# Altium schematic sheet Power_Regulators_Digital_2.SchDoc
size A4; DocumentNumber: 31; SheetNumber: 31; SheetTotal: 47
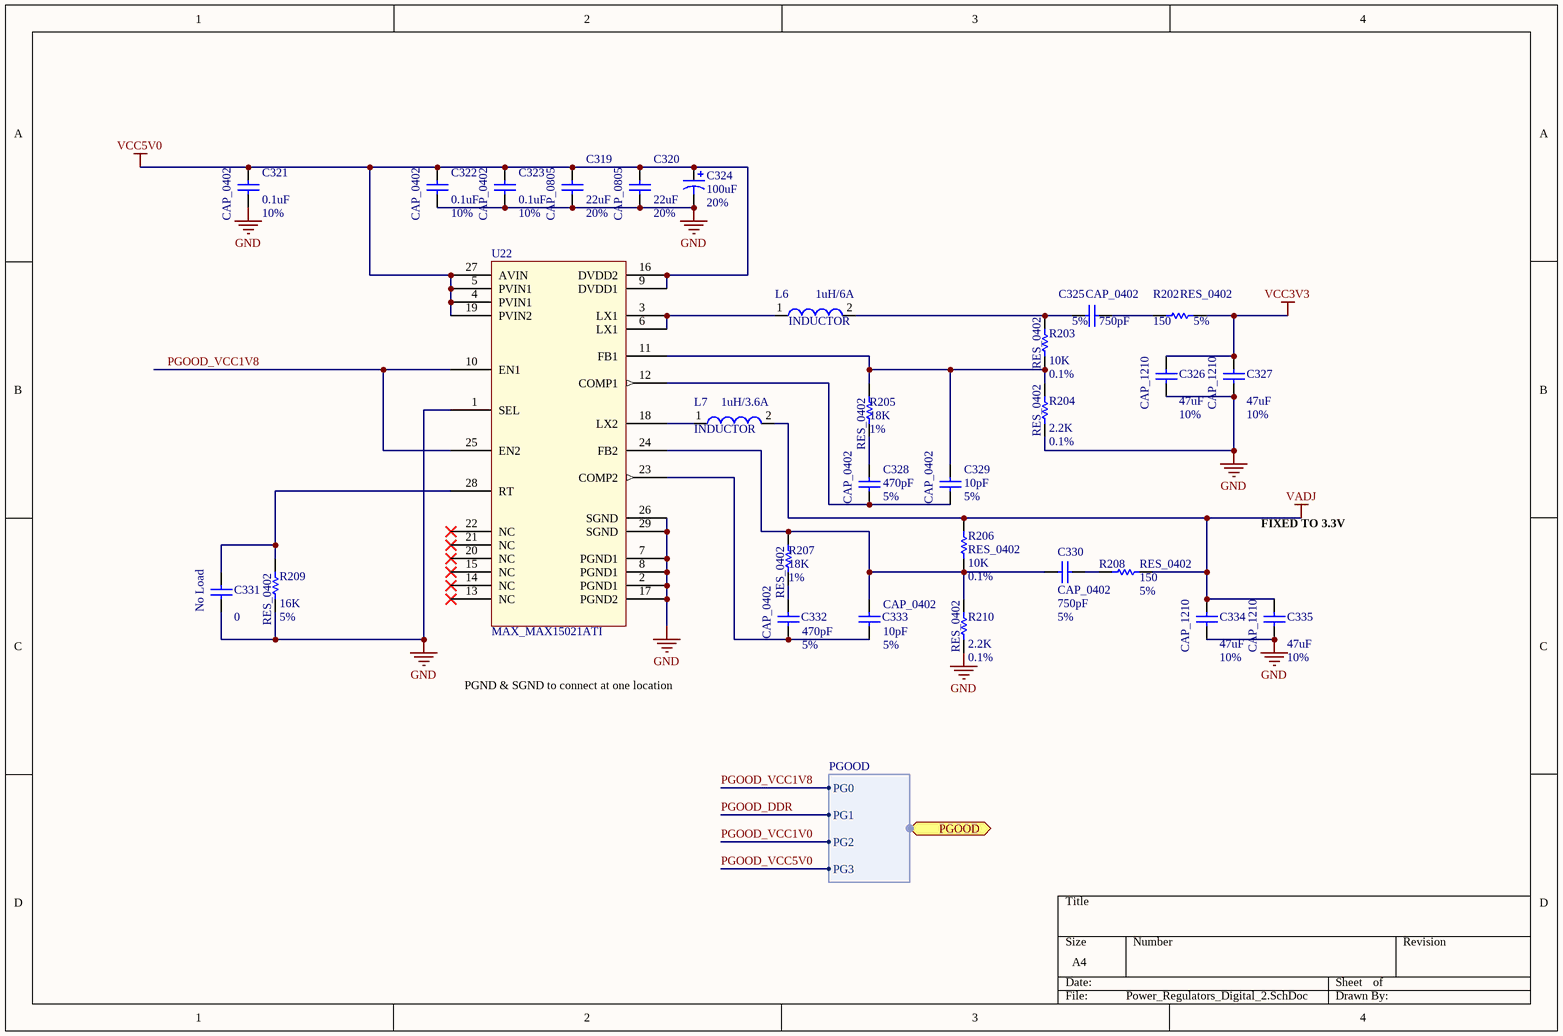
[diagram p0: Power_Regulators_Digital_2.SchDoc]

## Parts
C319  CAP_0805  value 22uF  Tolerance: 20%  [CAPC0805(2012)75_N]
C320  CAP_0805  value 22uF  Tolerance: 20%  [CAPC0805(2012)75_N]
C321  CAP_0402  value 0.1uF  Tolerance: 10%  [CAPC0402(1005)60_N]
C322  CAP_0402  value 0.1uF  Tolerance: 10%  [CAPC0402(1005)60_N]
C323  CAP_0402  value 0.1uF  Tolerance: 10%  [CAPC0402(1005)60_N]
C324  value 100uF  Tolerance: 20%  [Polarized_CAPC1210(3225)]  (hidden comment: Cap Pol1)
C325  CAP_0402  value 750pF  Tolerance: 5%  [CAPC0402(1005)60_N]
C326  CAP_1210  value 47uF  Tolerance: 10%  [CAPC1210(3225)100_N]
C327  CAP_1210  value 47uF  Tolerance: 10%  [CAPC1210(3225)100_N]
C328  CAP_0402  value 470pF  Tolerance: 5%  [CAPC0402(1005)60_N]
C329  CAP_0402  value 10pF  Tolerance: 5%  [CAPC0402(1005)60_N]
C330  CAP_0402  value 750pF  Tolerance: 5%  [CAPC0402(1005)60_N]
C331  value 0  Manufacturer: No Load  [CAPC0201(0603)33_N]  (hidden comment: CAP_0201)
C332  CAP_0402  value 470pF  Tolerance: 5%  [CAPC0402(1005)60_N]
C333  CAP_0402  value 10pF  Tolerance: 5%  [CAPC0402(1005)60_N]
C334  CAP_1210  value 47uF  Tolerance: 10%  [CAPC1210(3225)100_N]
C335  CAP_1210  value 47uF  Tolerance: 10%  [CAPC1210(3225)100_N]
L6  INDUCTOR  value 1uH/6A  [Inductor_SRN6045-Series_2-PIN]
L7  INDUCTOR  value 1uH/3.6A  [Inductor_NRS5020T1R0NMGJ_2-PIN]
R202  RES_0402  value 150  Tolerance: 5%  [RESC0402(1005)_N]
R203  RES_0402  value 10K  Tolerance: 0.1%  [RESC0402(1005)_N]
R204  RES_0402  value 2.2K  Tolerance: 0.1%  [RESC0402(1005)_N]
R205  RES_0402  value 18K  Tolerance: 1%  [RESC0402(1005)_N]
R206  RES_0402  value 10K  Tolerance: 0.1%  [RESC0402(1005)_N]
R207  RES_0402  value 18K  Tolerance: 1%  [RESC0402(1005)_N]
R208  RES_0402  value 150  Tolerance: 5%  [RESC0402(1005)_N]
R209  RES_0402  value 16K  Tolerance: 5%  [RESC0402(1005)_N]
R210  RES_0402  value 2.2K  Tolerance: 0.1%  [RESC0402(1005)_N]
U22  MAX_MAX15021ATI  [MAX_MAX15021ATI_28TQFN_T2855-6]

## Ports
PGOOD (harness PGOOD)

## Harnesses
PGOOD: PG0, PG1, PG2, PG3

## Nets
GND: C319.1 C320.1 C321.1 C322.1 C323.1 C324.2 C326.1 C327.1 C331.1 C334.1 C335.1 R204.1 R209.2 R210.1 U22.1(SEL) U22.2(PGND1) U22.7(PGND1) U22.8(PGND1) U22.17(PGND2) U22.26(SGND) U22.29(SGND)
VADJ: C334.2 C335.2 L7.2 R206.2 R208.2
VCC3V3: C326.2 C327.2 R202.2
VCC5V0: C319.2 C320.2 C321.2 C322.2 C323.2 C324.1 U22.4(PVIN1) U22.5(PVIN1) U22.9(DVDD1) U22.16(DVDD2) U22.19(PVIN2) U22.27(AVIN)
PGOOD_DDR: port PGOOD.PG1
PGOOD_VCC1V0: port PGOOD.PG2
PGOOD_VCC1V8: U22.10(EN1) U22.25(EN2) ; port PGOOD.PG0
PGOOD_VCC5V0: port PGOOD.PG3
NetC325_1: C325.1 L6.2 R203.2
NetC325_2: C325.2 R202.1
NetC328_1: C328.1 C329.1 U22.12(COMP1)
NetC328_2: C328.2 R205.1
NetC329_2: C329.2 R203.1 R204.2 R205.2 U22.11(FB1)
NetC330_1: C330.1 C333.2 R206.1 R207.2 R210.2 U22.24(FB2)
NetC330_2: C330.2 R208.1
NetC331_2: C331.2 R209.1 U22.28(RT)
NetC332_1: C332.1 C333.1 U22.23(COMP2)
NetC332_2: C332.2 R207.1
NetL6_1: L6.1 U22.3(LX1) U22.6(LX1)
NetL7_1: L7.1 U22.18(LX2)

Not connected (* = marked no-connect by the designer): U22 13(NC)* 14(NC)* 15(NC)* 20(NC)* 21(NC)* 22(NC)*

## Notes on the sheet
- FIXED TO 3.3V
- PGND & SGND to connect at one location

## Library data of the parts
C319 C320 = JMK212BJ226MG-T: 22uF, ceramic, 20%, 6.3V, X5R, 0805; Manufacturer: Taiyo Yuden; Part Number: JMK212BJ226MG-T; Footprint Ref: CAPC0805(2012)75_N; Library Ref: CAP_0805
C321-C323 = C1005X5R0J104K: 0.1uf, ceramic, 10%, 6.3V, X5R, 0402; Manufacturer: TDK Corporation; Part Number: C1005X5R0J104K; Footprint Ref: CAPC0402(1005)60_N; Library Ref: CAP_0402
C324 = TLCT107M010XTA: 100uF, tantalum, 20% 10V, 1210; Manufacturer: AVX Corporation; Part Number: TLCT107M010XTA; Footprint Ref: Polarized_CAPC1210(3225); Library Ref: Cap Pol1
C325 C330 = C0402C751J3GACTU: 750pF, ceramic, 5% 25V NP0, 0402; Manufacturer: Kemet; Part Number: C0402C751J3GACTU; Footprint Ref: CAPC0402(1005)60_N; Library Ref: CAP_0402
C326 C327 C334 C335 = GRM32ER61A476KE20L: 47uF, ceramic 10% 10V, X5R, 1210; Manufacturer: Murata Electronics North America; Part Number: GRM32ER61A476KE20L; Footprint Ref: CAPC1210(3225)100_N; Library Ref: CAP_1210
C328 C332 = ECJ-0EB1E471K: 470pF, ceramic, 5%, 25V, X7R, 0402; Manufacturer: Panasonic-ECG; Part Number: ECJ-0EB1E471K; Footprint Ref: CAPC0402(1005)60_N; Library Ref: CAP_0402
C329 C333 = VJ0402A100JXACW1BC: 10pF, ceramic, 5%, 50V, NP0, 0402; Manufacturer: BC COMPONENTS; Part Number: VJ0402A100JXACW1BC; Footprint Ref: CAPC0402(1005)60_N; Library Ref: CAP_0402
C331 = No Load_0: Generic Capacitor; Tolerance: *; Part Number: No Load_0; Footprint Ref: CAPC0201(0603)33_N; Library Ref: CAP_0201
L6 = SRN6045-1R0Y: SRN6045-1R0Y, 1uH 4.2A-8.5A, CDRH6D38; Manufacturer: Bourns; Tolerance: *; Part Number: SRN6045-1R0Y; Footprint Ref: Inductor_SRN6045-Series_2-PIN; Library Ref: INDUCTOR
L7 = NRS5020T1R0NMGJ: NRS5020T1R0NMGJ, 1uH 3.6A, 5020; Manufacturer: Taiyo Yuden; Tolerance: *; Part Number: NRS5020T1R0NMGJ; Footprint Ref: Inductor_NRS5020T1R0NMGJ_2-PIN; Library Ref: INDUCTOR
R202 R208 = RC0402JR-07150RL: 150 ohm, 5% 1/16W, 0402; Manufacturer: Yageo America; Part Number: RC0402JR-07150RL; Footprint Ref: RESC0402(1005)_N; Library Ref: RES_0402
R203 R206 = ERA-2AEB103X: 10K ohm, 0.1% 1/16W, 0402; Manufacturer: Panasonic - ECG; Part Number: ERA-2AEB103X; Footprint Ref: RESC0402(1005)_N; Library Ref: RES_0402
R204 R210 = ERA-2AEB222X: 2.2K ohm, 0.1% 1/16W, 0402; Manufacturer: Panasonic - ECG; Part Number: ERA-2AEB222X; Footprint Ref: RESC0402(1005)_N; Library Ref: RES_0402
R205 R207 = MCR01MZPF1802: 18K ohm, 1% 1/16W, 0402; Manufacturer: ROHM; Part Number: MCR01MZPF1802; Footprint Ref: RESC0402(1005)_N; Library Ref: RES_0402
R209 = CRCW040216K0JNED: 16K ohm, 5% 1/16W, 0402; Manufacturer: Vishay/Dale; Part Number: CRCW040216K0JNED; Footprint Ref: RESC0402(1005)_N; Library Ref: RES_0402
U22 = MAX15021ATI+: MAX15021ATI, 4A/2A, 4MHz, Step-Down DC-DC Regulator, TQFN28; Manufacturer: Maxim Integrated Products; Part Number: MAX15021ATI+